# EAGLE board measure_board (EAGLE 7.2.0), part 1 of 2
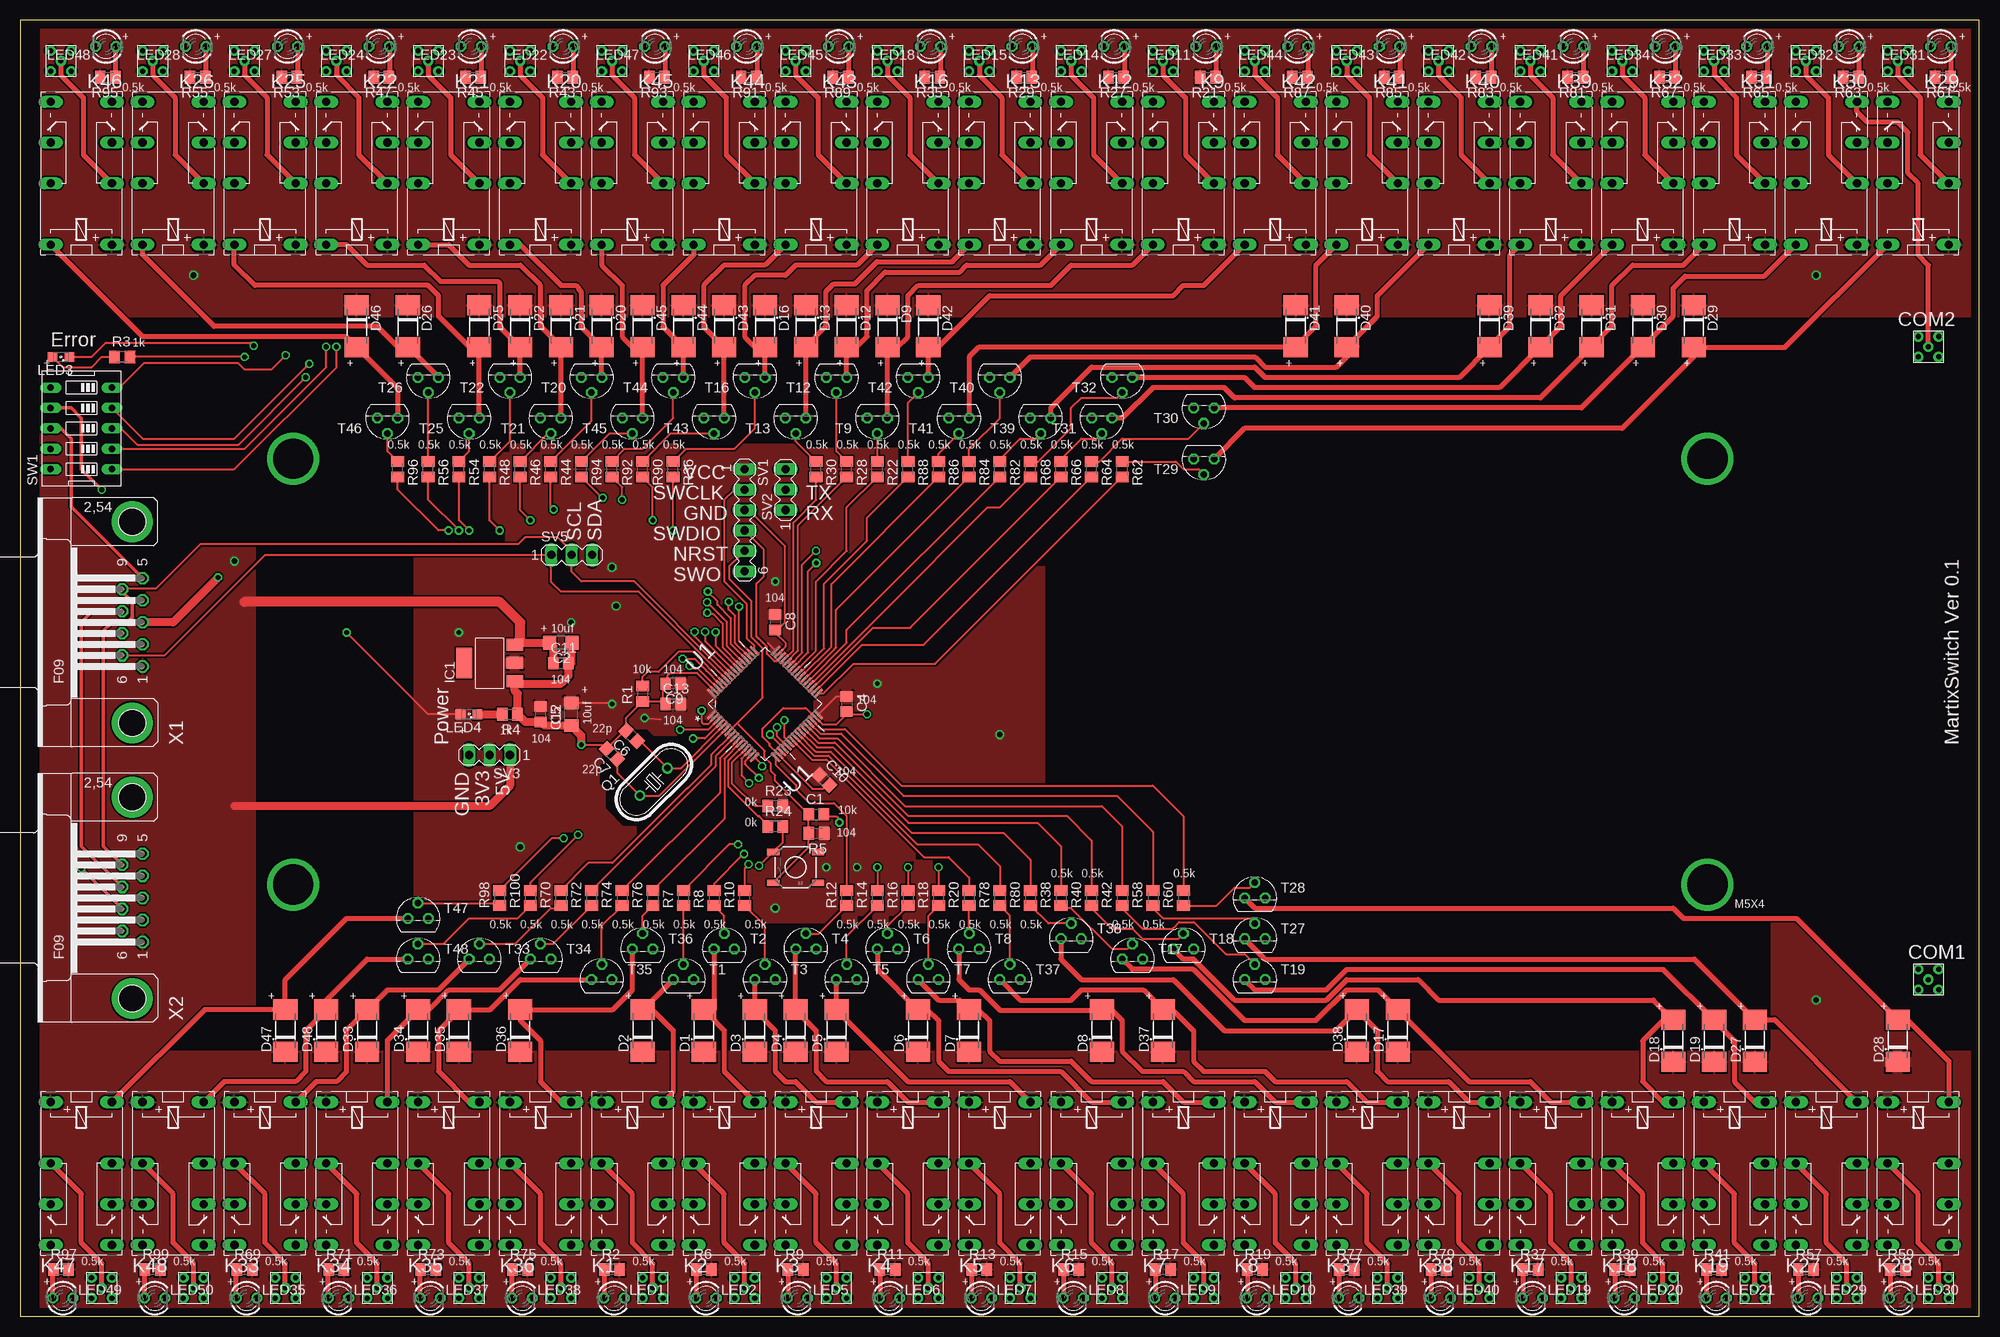
[diagram p2: board, top side]
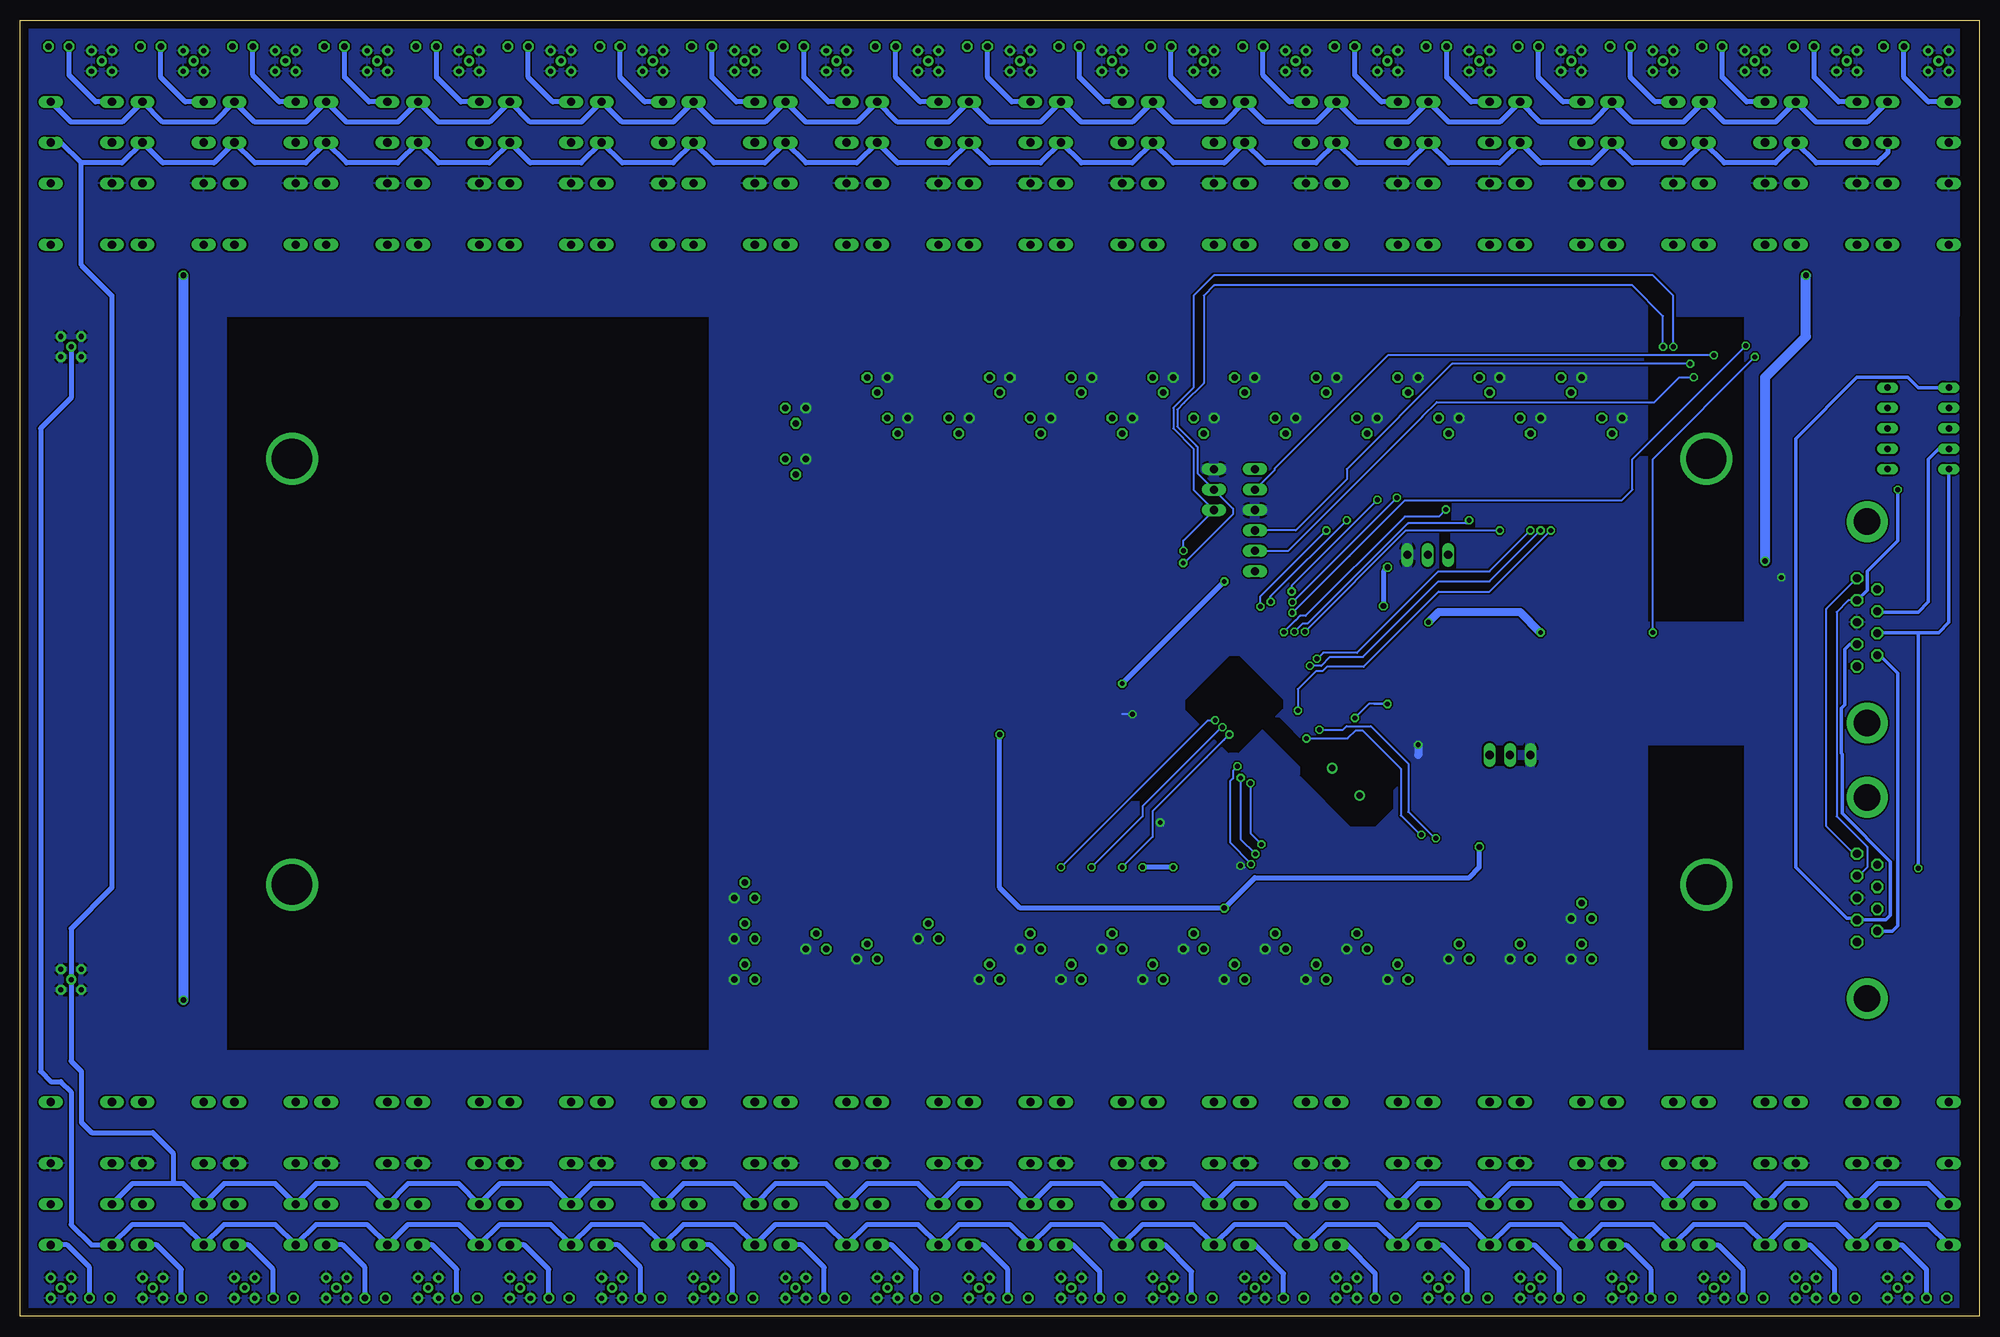
[diagram p3: board, bottom side, seen from below]

Size 243.84 x 161.29 mm. Coordinates in mm from the lower left corner, seen from the top.
Outline: 0,161.29 0,0 243.84,0 243.84,161.29 0,161.29
Copper layers (1*16): Top 0.035mm / dielectric 1.5mm / Bottom 0.035mm
Design rules "default": minimum track width 10mil, minimum drill 24mil, track to track 8mil, track to pad 8mil, pad to pad 8mil, via to via 8mil, smd to smd 8mil, copper to edge 40mil, drill to drill 8mil, minimum pad ring 10mil, minimum via ring 8mil, stop-mask expansion 4mil, vias tented up to drill 0mil, thermal gap 10mil

## Footprints (pad centres in the part's own frame; a part is rotated, then mirrored left to right if it is on the bottom)
C0805 = smd 1.3 x 1.5: 1 -0.95,0; 2 0.95,0
C1206 = smd 1.6 x 1.8: 1 -1.4,0; 2 1.4,0
MELF-MLL41_DO213AB = smd 2.5 x 3: A 2.625,0; C -2.625,0
SOT223 = smd 1.499 x 2.007: 1 -2.261,-3.15; 2 0.025,-3.15; 3 2.311,-3.15 | smd 3.81 x 2.007: 4 0,3.15
G6A-234P = drill 1.016 long: 1 -3.81,-3.81; 16 -3.81,3.81; O1 8.89,-3.81; O2 8.89,3.81; P1 3.81,-3.81; P2 3.81,3.81; S1 13.97,-3.81; S2 13.97,3.81
LED3MM = drill 0.813 octagon: A -1.27,0; K 1.27,0
SML0805 = smd 1.2 x 1.2: A 1.05,0; C -1.05,0
HC49U70 = drill 0.813: 1 -2.413,0; 2 2.413,0
M0805 = smd 1.3 x 1.6: 1 -0.95,0; 2 0.95,0
TACTILE-SWITCH-SMD = smd 1.524 x 0.762: 1 -2.794,1.905; 2 2.794,1.905; 3 -2.794,-1.905; 4 2.794,-1.905
MA06-1 = drill 1.016 long: 1 -6.35,0; 2 -3.81,0; 3 -1.27,0; 4 1.27,0; 5 3.81,0; 6 6.35,0
MA03-1 = drill 1.016 long: 1 -2.54,0; 2 0,0; 3 2.54,0
EDG-05 = drill 0.813 long: 1 -5.08,-3.81; 2 -2.54,-3.81; 3 0,-3.81; 4 2.54,-3.81; 5 5.08,-3.81; 6 5.08,3.81; 7 2.54,3.81; 8 0,3.81; 9 -2.54,3.81; 10 -5.08,3.81
TO92 = drill 0.813 octagon: 1 1.27,0; 2 0,1.905; 3 -1.27,0
QFP50P1200X1200X160-64N = smd 1.473 x 0.279: 1 -5.613,3.759; 2 -5.613,3.251; 3 -5.613,2.743; 4 -5.613,2.261; 5 -5.613,1.753; 6 -5.613,1.245; 7 -5.613,0.762; 8 -5.613,0.254; 9 -5.613,-0.254; 10 -5.613,-0.762; 11 -5.613,-1.245; 12 -5.613,-1.753; 13 -5.613,-2.261; 14 -5.613,-2.743; 15 -5.613,-3.251; 16 -5.613,-3.759; 33 5.613,-3.759; 34 5.613,-3.251; 35 5.613,-2.743; 36 5.613,-2.261; 37 5.613,-1.753; 38 5.613,-1.245; 39 5.613,-0.762; 40 5.613,-0.254; 41 5.613,0.254; 42 5.613,0.762; 43 5.613,1.245; 44 5.613,1.753; 45 5.613,2.261; 46 5.613,2.743; 47 5.613,3.251; 48 5.613,3.759 | smd 0.279 x 1.473: 17 -3.759,-5.613; 18 -3.251,-5.613; 19 -2.743,-5.613; 20 -2.261,-5.613; 21 -1.753,-5.613; 22 -1.245,-5.613; 23 -0.762,-5.613; 24 -0.254,-5.613; 25 0.254,-5.613; 26 0.762,-5.613; 27 1.245,-5.613; 28 1.753,-5.613; 29 2.261,-5.613; 30 2.743,-5.613; 31 3.251,-5.613; 32 3.759,-5.613; 49 3.759,5.613; 50 3.251,5.613; 51 2.743,5.613; 52 2.261,5.613; 53 1.753,5.613; 54 1.245,5.613; 55 0.762,5.613; 56 0.254,5.613; 57 -0.254,5.613; 58 -0.762,5.613; 59 -1.245,5.613; 60 -1.753,5.613; 61 -2.261,5.613; 62 -2.743,5.613; 63 -3.251,5.613; 64 -3.759,5.613
100MIL = drill 0.635 pad 1.27: P$1 0,0; P$2 -1.27,1.27; P$3 1.27,1.27; P$4 1.27,-1.27; P$5 -1.27,-1.27
F09HP = drill 1.016 octagon: 1 -5.486,-1.27; 2 -2.743,-1.27; 3 0,-1.27; 4 2.743,-1.27; 5 5.486,-1.27; 6 -4.115,1.27; 7 -1.372,1.27; 8 1.372,1.27; 9 4.115,1.27 | drill 3.302 pad 5.08: G1 -12.522,0; G2 12.522,0

## Placement (x,y rotation side)
C1  104  [C0805]  99.09,62.47 0 top
C2  10uf  [C1206]  67.31,83.82 180 top
C4  104  [C0805]  102.87,76.2 270 top
C5  10uf  [C1206]  68.58,74.93 90 top
C6  22p  [C0805]  76.09,72.22 135 top
C7  22p  [C0805]  73.66,69.98 135 top
C8  104  [C0805]  93.98,86.36 270 top
C9  104  [C0805]  81.28,78.74 180 top
C10  104  [C0805]  100.08,66.74 315 top
C11  104  [C0805]  67.31,81.28 0 top
C12  104  [C0805]  64.77,74.93 270 top
C13  104  [C0805]  81.28,76.2 0 top
D1  SM4007  [MELF-MLL41_DO213AB]  85.09,35.56 90 top
D2  SM4007  [MELF-MLL41_DO213AB]  77.47,35.56 90 top
D3  SM4007  [MELF-MLL41_DO213AB]  91.44,35.56 90 top
D4  SM4007  [MELF-MLL41_DO213AB]  96.52,35.56 90 top
D5  SM4007  [MELF-MLL41_DO213AB]  101.6,35.56 90 top
D6  SM4007  [MELF-MLL41_DO213AB]  111.76,35.56 90 top
D7  SM4007  [MELF-MLL41_DO213AB]  118.11,35.56 90 top
D8  SM4007  [MELF-MLL41_DO213AB]  134.62,35.56 90 top
D9  SM4007  [MELF-MLL41_DO213AB]  107.95,123.19 270 top
D12  SM4007  [MELF-MLL41_DO213AB]  102.87,123.19 270 top
D13  SM4007  [MELF-MLL41_DO213AB]  97.79,123.19 270 top
D16  SM4007  [MELF-MLL41_DO213AB]  92.71,123.19 270 top
D17  SM4007  [MELF-MLL41_DO213AB]  171.45,35.56 90 top
D18  SM4007  [MELF-MLL41_DO213AB]  205.74,34.29 90 top
D19  SM4007  [MELF-MLL41_DO213AB]  210.82,34.29 90 top
D20  SM4007  [MELF-MLL41_DO213AB]  72.39,123.19 270 top
D21  SM4007  [MELF-MLL41_DO213AB]  67.31,123.19 270 top
D22  SM4007  [MELF-MLL41_DO213AB]  62.23,123.19 270 top
D25  SM4007  [MELF-MLL41_DO213AB]  57.15,123.19 270 top
D26  SM4007  [MELF-MLL41_DO213AB]  48.26,123.19 270 top
D27  SM4007  [MELF-MLL41_DO213AB]  215.9,34.29 90 top
D28  SM4007  [MELF-MLL41_DO213AB]  233.68,34.29 90 top
D29  SM4007  [MELF-MLL41_DO213AB]  208.28,123.19 270 top
D30  SM4007  [MELF-MLL41_DO213AB]  201.93,123.19 270 top
D31  SM4007  [MELF-MLL41_DO213AB]  195.58,123.19 270 top
D32  SM4007  [MELF-MLL41_DO213AB]  189.23,123.19 270 top
D33  SM4007  [MELF-MLL41_DO213AB]  43.18,35.56 90 top
D34  SM4007  [MELF-MLL41_DO213AB]  49.53,35.56 90 top
D35  SM4007  [MELF-MLL41_DO213AB]  54.61,35.56 90 top
D36  SM4007  [MELF-MLL41_DO213AB]  62.23,35.56 90 top
D37  SM4007  [MELF-MLL41_DO213AB]  142.24,35.56 90 top
D38  SM4007  [MELF-MLL41_DO213AB]  166.37,35.56 90 top
D39  SM4007  [MELF-MLL41_DO213AB]  182.88,123.19 270 top
D40  SM4007  [MELF-MLL41_DO213AB]  165.1,123.19 270 top
D41  SM4007  [MELF-MLL41_DO213AB]  158.75,123.19 270 top
D42  SM4007  [MELF-MLL41_DO213AB]  113.03,123.19 270 top
D43  SM4007  [MELF-MLL41_DO213AB]  87.63,123.19 270 top
D44  SM4007  [MELF-MLL41_DO213AB]  82.55,123.19 270 top
D45  SM4007  [MELF-MLL41_DO213AB]  77.47,123.19 270 top
D46  SM4007  [MELF-MLL41_DO213AB]  41.91,123.19 270 top
D47  SM4007  [MELF-MLL41_DO213AB]  33.02,35.56 90 top
D48  SM4007  [MELF-MLL41_DO213AB]  38.1,35.56 90 top
IC1  REG1117  [SOT223]  58.42,81.28 90 top
K1  G6A-234P  [G6A-234P]  76.2,22.86 270 top
K2  G6A-234P  [G6A-234P]  87.63,22.86 270 top
K3  G6A-234P  [G6A-234P]  99.06,22.86 270 top
K4  G6A-234P  [G6A-234P]  110.49,22.86 270 top
K5  G6A-234P  [G6A-234P]  121.92,22.86 270 top
K6  G6A-234P  [G6A-234P]  133.35,22.86 270 top
K7  G6A-234P  [G6A-234P]  144.78,22.86 270 top
K8  G6A-234P  [G6A-234P]  156.21,22.86 270 top
K9  G6A-234P  [G6A-234P]  144.78,137.16 90 top
K12  G6A-234P  [G6A-234P]  133.35,137.16 90 top
K13  G6A-234P  [G6A-234P]  121.92,137.16 90 top
K16  G6A-234P  [G6A-234P]  110.49,137.16 90 top
K17  G6A-234P  [G6A-234P]  190.5,22.86 270 top
K18  G6A-234P  [G6A-234P]  201.93,22.86 270 top
K19  G6A-234P  [G6A-234P]  213.36,22.86 270 top
K20  G6A-234P  [G6A-234P]  64.77,137.16 90 top
K21  G6A-234P  [G6A-234P]  53.34,137.16 90 top
K22  G6A-234P  [G6A-234P]  41.91,137.16 90 top
K25  G6A-234P  [G6A-234P]  30.48,137.16 90 top
K26  G6A-234P  [G6A-234P]  19.05,137.16 90 top
K27  G6A-234P  [G6A-234P]  224.79,22.86 270 top
K28  G6A-234P  [G6A-234P]  236.22,22.86 270 top
K29  G6A-234P  [G6A-234P]  236.22,137.16 90 top
K30  G6A-234P  [G6A-234P]  224.79,137.16 90 top
K31  G6A-234P  [G6A-234P]  213.36,137.16 90 top
K32  G6A-234P  [G6A-234P]  201.93,137.16 90 top
K33  G6A-234P  [G6A-234P]  30.48,22.86 270 top
K34  G6A-234P  [G6A-234P]  41.91,22.86 270 top
K35  G6A-234P  [G6A-234P]  53.34,22.86 270 top
K36  G6A-234P  [G6A-234P]  64.77,22.86 270 top
K37  G6A-234P  [G6A-234P]  167.64,22.86 270 top
K38  G6A-234P  [G6A-234P]  179.07,22.86 270 top
K39  G6A-234P  [G6A-234P]  190.5,137.16 90 top
K40  G6A-234P  [G6A-234P]  179.07,137.16 90 top
K41  G6A-234P  [G6A-234P]  167.64,137.16 90 top
K42  G6A-234P  [G6A-234P]  156.21,137.16 90 top
K43  G6A-234P  [G6A-234P]  99.06,137.16 90 top
K44  G6A-234P  [G6A-234P]  87.63,137.16 90 top
K45  G6A-234P  [G6A-234P]  76.2,137.16 90 top
K46  G6A-234P  [G6A-234P]  7.62,137.16 90 top
K47  G6A-234P  [G6A-234P]  7.62,22.86 270 top
K48  G6A-234P  [G6A-234P]  19.05,22.86 270 top
LED1  [LED3MM]  73.91,2.29 0 top
LED2  [LED3MM]  85.34,2.29 0 top
LED3  [SML0805]  5.08,119.38 180 top
LED4  [SML0805]  55.88,74.93 180 top
LED5  [LED3MM]  96.77,2.29 0 top
LED6  [LED3MM]  108.2,2.29 0 top
LED7  [LED3MM]  119.63,2.29 0 top
LED8  [LED3MM]  131.06,2.29 0 top
LED9  [LED3MM]  142.49,2.29 0 top
LED10  [LED3MM]  153.92,2.29 0 top
LED11  [LED3MM]  147.57,157.99 180 top
LED14  [LED3MM]  136.14,157.99 180 top
LED15  [LED3MM]  124.71,157.99 180 top
LED18  [LED3MM]  113.28,157.99 180 top
LED19  [LED3MM]  188.21,2.29 0 top
LED20  [LED3MM]  199.64,2.29 0 top
LED21  [LED3MM]  211.07,2.29 0 top
LED22  [LED3MM]  67.56,157.99 180 top
LED23  [LED3MM]  56.13,157.99 180 top
LED24  [LED3MM]  44.7,157.99 180 top
LED27  [LED3MM]  33.27,157.99 180 top
LED28  [LED3MM]  21.84,157.99 180 top
LED29  [LED3MM]  222.5,2.29 0 top
LED30  [LED3MM]  233.93,2.29 0 top
LED31  [LED3MM]  239.01,157.99 180 top
LED32  [LED3MM]  227.58,157.99 180 top
LED33  [LED3MM]  216.15,157.99 180 top
LED34  [LED3MM]  204.72,157.99 180 top
LED35  [LED3MM]  28.19,2.29 0 top
LED36  [LED3MM]  39.62,2.29 0 top
LED37  [LED3MM]  51.05,2.29 0 top
LED38  [LED3MM]  62.48,2.29 0 top
LED39  [LED3MM]  165.35,2.29 0 top
LED40  [LED3MM]  176.78,2.29 0 top
LED41  [LED3MM]  193.29,157.99 180 top
LED42  [LED3MM]  181.86,157.99 180 top
LED43  [LED3MM]  170.43,157.99 180 top
LED44  [LED3MM]  159,157.99 180 top
LED45  [LED3MM]  101.85,157.99 180 top
LED46  [LED3MM]  90.42,157.99 180 top
LED47  [LED3MM]  78.99,157.99 180 top
LED48  [LED3MM]  10.67,157.99 180 top
LED49  [LED3MM]  5.33,2.29 0 top
LED50  [LED3MM]  16.76,2.29 0 top
Q1  8MHZ  [HC49U70]  78.86,66.5 45 top
R1  10k  [M0805]  77.47,77.47 90 top
R2  0.5k  [M0805]  73.66,5.84 0 top
R3  1k  [M0805]  12.7,119.38 0 top
R4  1k  [M0805]  60.96,74.93 180 top
R5  10k  [M0805]  99.13,60.12 180 top
R6  0.5k  [M0805]  85.09,5.84 0 top
R7  0.5k  [M0805]  82.55,52.07 90 top
R8  0.5k  [M0805]  86.36,52.07 90 top
R9  0.5k  [M0805]  96.52,5.84 0 top
R10  0.5k  [M0805]  90.17,52.07 90 top
R11  0.5k  [M0805]  107.95,5.84 0 top
R12  0.5k  [M0805]  102.87,52.07 90 top
R13  0.5k  [M0805]  119.38,5.84 0 top
R14  0.5k  [M0805]  106.68,52.07 90 top
R15  0.5k  [M0805]  130.81,5.84 0 top
R16  0.5k  [M0805]  110.49,52.07 90 top
R17  0.5k  [M0805]  142.24,5.84 0 top
R18  0.5k  [M0805]  114.3,52.07 90 top
R19  0.5k  [M0805]  153.67,5.84 0 top
R20  0.5k  [M0805]  118.11,52.07 90 top
R21  0.5k  [M0805]  147.83,154.18 180 top
R22  0.5k  [M0805]  106.68,105.41 270 top
R23  0k  [M0805]  93.98,63.5 0 top
R24  0k  [M0805]  93.98,60.96 0 top
R27  0.5k  [M0805]  136.4,154.18 180 top
R28  0.5k  [M0805]  102.87,105.41 270 top
R29  0.5k  [M0805]  124.97,154.18 180 top
R30  0.5k  [M0805]  99.06,105.41 270 top
R35  0.5k  [M0805]  113.54,154.18 180 top
R36  0.5k  [M0805]  81.28,105.41 270 top
R37  0.5k  [M0805]  187.96,5.84 0 top
R38  0.5k  [M0805]  129.54,52.07 90 top
R39  0.5k  [M0805]  199.39,5.84 0 top
R40  0.5k  [M0805]  133.35,52.07 90 top
R41  0.5k  [M0805]  210.82,5.84 0 top
R42  0.5k  [M0805]  137.16,52.07 90 top
R43  0.5k  [M0805]  67.82,154.18 180 top
R44  0.5k  [M0805]  66.04,105.41 270 top
R45  0.5k  [M0805]  56.39,154.18 180 top
R46  0.5k  [M0805]  62.23,105.41 270 top
R47  0.5k  [M0805]  44.96,154.18 180 top
R48  0.5k  [M0805]  58.42,105.41 270 top
R53  0.5k  [M0805]  33.53,154.18 180 top
R54  0.5k  [M0805]  54.61,105.41 270 top
R55  0.5k  [M0805]  22.1,154.18 180 top
R56  0.5k  [M0805]  50.8,105.41 270 top
R57  0.5k  [M0805]  222.25,5.84 0 top
R58  0.5k  [M0805]  140.97,52.07 90 top
R59  0.5k  [M0805]  233.68,5.84 0 top
R60  0.5k  [M0805]  144.78,52.07 90 top
R61  0.5k  [M0805]  239.27,154.18 180 top
R62  0.5k  [M0805]  137.16,105.41 270 top
R63  0.5k  [M0805]  227.84,154.18 180 top
R64  0.5k  [M0805]  133.35,105.41 270 top
R65  0.5k  [M0805]  216.41,154.18 180 top
R66  0.5k  [M0805]  129.54,105.41 270 top
R67  0.5k  [M0805]  204.98,154.18 180 top
R68  0.5k  [M0805]  125.73,105.41 270 top
R69  0.5k  [M0805]  27.94,5.84 0 top
R70  0.5k  [M0805]  67.31,52.07 90 top
R71  0.5k  [M0805]  39.37,5.84 0 top
R72  0.5k  [M0805]  71.12,52.07 90 top
R73  0.5k  [M0805]  50.8,5.84 0 top
R74  0.5k  [M0805]  74.93,52.07 90 top
R75  0.5k  [M0805]  62.23,5.84 0 top
R76  0.5k  [M0805]  78.74,52.07 90 top
R77  0.5k  [M0805]  165.1,5.84 0 top
R78  0.5k  [M0805]  121.92,52.07 90 top
R79  0.5k  [M0805]  176.53,5.84 0 top
R80  0.5k  [M0805]  125.73,52.07 90 top
R81  0.5k  [M0805]  193.55,154.18 180 top
R82  0.5k  [M0805]  121.92,105.41 270 top
R83  0.5k  [M0805]  182.12,154.18 180 top
R84  0.5k  [M0805]  118.11,105.41 270 top
R85  0.5k  [M0805]  170.69,154.18 180 top
R86  0.5k  [M0805]  114.3,105.41 270 top
R87  0.5k  [M0805]  159.26,154.18 180 top
R88  0.5k  [M0805]  110.49,105.41 270 top
R89  0.5k  [M0805]  102.11,154.18 180 top
R90  0.5k  [M0805]  77.47,105.41 270 top
R91  0.5k  [M0805]  90.68,154.18 180 top
R92  0.5k  [M0805]  73.66,105.41 270 top
R93  0.5k  [M0805]  79.25,154.18 180 top
R94  0.5k  [M0805]  69.85,105.41 270 top
R95  0.5k  [M0805]  10.92,154.18 180 top
R96  0.5k  [M0805]  46.99,105.41 270 top
R97  0.5k  [M0805]  5.08,5.84 0 top
R98  0.5k  [M0805]  59.69,52.07 90 top
R99  0.5k  [M0805]  16.51,5.84 0 top
R100  0.5k  [M0805]  63.5,52.07 90 top
S2  TAC_SWITCHSMD  [TACTILE-SWITCH-SMD]  96.52,55.88 180 top
SV1  [MA06-1]  90.17,99.06 270 top
SV2  [MA03-1]  95.25,102.87 90 top
SV3  [MA03-1]  58.42,69.85 180 top
SV5  [MA03-1]  68.65,94.75 0 top
SW1  [EDG-05]  7.62,110.49 90 top
T1  BC238  [TO92]  82.55,41.91 0 top
T2  BC238  [TO92]  87.63,45.72 0 top
T3  BC238  [TO92]  92.71,41.91 0 top
T4  BC238  [TO92]  97.79,45.72 0 top
T5  BC238  [TO92]  102.87,41.91 0 top
T6  BC238  [TO92]  107.95,45.72 0 top
T7  BC238  [TO92]  113.03,41.91 0 top
T8  BC238  [TO92]  118.11,45.72 0 top
T9  BC238  [TO92]  106.68,111.76 180 top
T12  BC238  [TO92]  101.6,116.84 180 top
T13  BC238  [TO92]  96.52,111.76 180 top
T16  BC238  [TO92]  91.44,116.84 180 top
T17  BC238  [TO92]  138.43,44.45 0 top
T18  BC238  [TO92]  144.78,45.72 0 top
T19  BC238  [TO92]  153.67,41.91 0 top
T20  BC238  [TO92]  71.12,116.84 180 top
T21  BC238  [TO92]  66.04,111.76 180 top
T22  BC238  [TO92]  60.96,116.84 180 top
T25  BC238  [TO92]  55.88,111.76 180 top
T26  BC238  [TO92]  50.8,116.84 180 top
T27  BC238  [TO92]  153.67,46.99 0 top
T28  BC238  [TO92]  153.67,52.07 0 top
T29  BC238  [TO92]  147.32,106.68 180 top
T30  BC238  [TO92]  147.32,113.03 180 top
T31  BC238  [TO92]  134.62,111.76 180 top
T32  BC238  [TO92]  137.16,116.84 180 top
T33  BC238  [TO92]  57.15,44.45 0 top
T34  BC238  [TO92]  64.77,44.45 0 top
T35  BC238  [TO92]  72.39,41.91 0 top
T36  BC238  [TO92]  77.47,45.72 0 top
T37  BC238  [TO92]  123.19,41.91 0 top
T38  BC238  [TO92]  130.81,46.99 0 top
T39  BC238  [TO92]  127,111.76 180 top
T40  BC238  [TO92]  121.92,116.84 180 top
T41  BC238  [TO92]  116.84,111.76 180 top
T42  BC238  [TO92]  111.76,116.84 180 top
T43  BC238  [TO92]  86.36,111.76 180 top
T44  BC238  [TO92]  81.28,116.84 180 top
T45  BC238  [TO92]  76.2,111.76 180 top
T46  BC238  [TO92]  45.72,111.76 180 top
T47  BC238  [TO92]  49.53,49.53 0 top
T48  BC238  [TO92]  49.53,44.45 0 top
U1  STM32F103RBT6  [QFP50P1200X1200X160-64N]  92.71,76.2 45 top
U$1  100MILS  [100MIL]  33.02,3.56 90 top
U$2  100MILS  [100MIL]  44.45,3.56 90 top
U$3  100MILS  [100MIL]  55.88,3.56 90 top
U$4  100MILS  [100MIL]  67.31,3.56 0 top
U$5  100MILS  [100MIL]  176.53,156.21 0 top
U$6  100MILS  [100MIL]  187.96,156.21 0 top
U$7  100MILS  [100MIL]  181.61,3.56 0 top
U$8  100MILS  [100MIL]  170.18,3.56 0 top
U$9  100MILS  [100MIL]  165.1,156.21 0 top
U$10  100MILS  [100MIL]  153.67,156.21 0 top
U$11  100MILS  [100MIL]  96.52,156.21 0 top
U$12  100MILS  [100MIL]  85.09,156.21 0 top
U$13  100MILS  [100MIL]  73.66,156.21 0 top
U$14  100MILS  [100MIL]  5.08,156.21 0 top
U$15  100MILS  [100MIL]  10.16,3.56 0 top
U$16  100MILS  [100MIL]  21.59,3.56 0 top
U$17  100MILS  [100MIL]  233.68,156.21 0 top
U$18  100MILS  [100MIL]  27.94,156.21 0 top
U$19  100MILS  [100MIL]  222.25,156.21 0 top
U$20  100MILS  [100MIL]  16.51,156.21 90 top
U$21  100MILS  [100MIL]  210.82,156.21 0 top
U$22  100MILS  [100MIL]  227.33,3.56 0 top
U$23  100MILS  [100MIL]  199.39,156.21 0 top
U$24  100MILS  [100MIL]  238.76,3.56 0 top
U$25  100MILS  [100MIL]  39.37,156.21 0 top
U$26  100MILS  [100MIL]  50.8,156.21 0 top
U$27  100MILS  [100MIL]  193.04,3.56 0 top
U$28  100MILS  [100MIL]  204.47,3.56 0 top
U$29  100MILS  [100MIL]  215.9,3.56 0 top
U$30  100MILS  [100MIL]  62.23,156.21 0 top
U$31  100MILS  [100MIL]  107.95,156.21 0 top
U$32  100MILS  [100MIL]  119.38,156.21 0 top
U$33  100MILS  [100MIL]  142.24,156.21 0 top
U$34  100MILS  [100MIL]  124.46,3.56 0 top
U$35  100MILS  [100MIL]  135.89,3.56 0 top
U$36  100MILS  [100MIL]  147.32,3.56 0 top
U$37  100MILS  [100MIL]  158.75,3.56 0 top
U$38  100MILS  [100MIL]  113.03,3.56 0 top
U$39  100MILS  [100MIL]  101.6,3.56 0 top
U$40  100MILS  [100MIL]  90.17,3.56 0 top
U$41  100MILS  [100MIL]  78.74,3.56 0 top
U$42  100MILS  [100MIL]  237.49,41.91 0 top
U$43  100MILS  [100MIL]  237.49,120.65 0 top
U$44  100MILS  [100MIL]  130.81,156.21 0 top
X1  [F09HP]  13.97,86.36 90 top
X2  [F09HP]  13.97,52.07 90 top